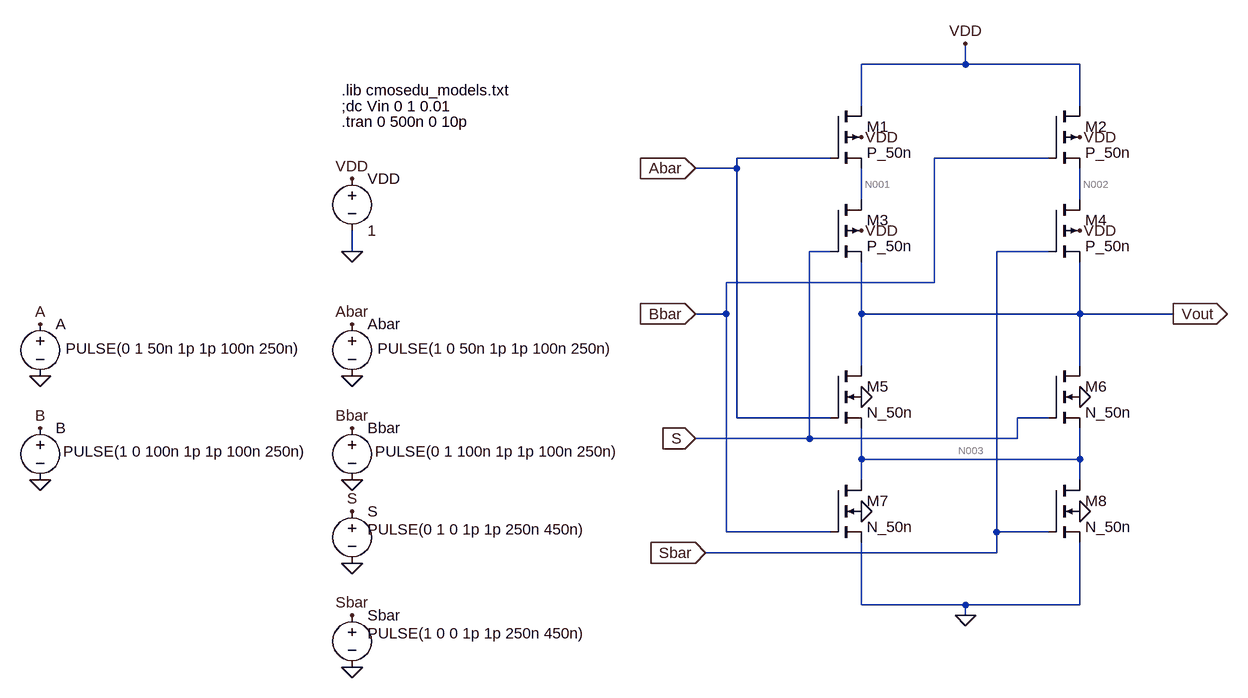
[diagram p0: schematic 2in1MUX.asc]
2in1MUX.asc, the LTspice schematic file:
Version 4
SHEET 1 960 680
WIRE 64 -528 64 -560
WIRE 64 -528 -96 -528
WIRE 240 -528 64 -528
WIRE -96 -464 -96 -528
WIRE 240 -464 240 -528
WIRE -144 -384 -288 -384
WIRE 192 -384 16 -384
WIRE -288 -368 -288 -384
WIRE -288 -368 -352 -368
WIRE -96 -320 -96 -368
WIRE 240 -320 240 -368
WIRE -880 -240 -880 -272
WIRE -144 -240 -176 -240
WIRE 192 -240 112 -240
WIRE 16 -192 16 -384
WIRE 16 -192 -304 -192
WIRE -304 -144 -304 -192
WIRE -304 -144 -352 -144
WIRE -96 -144 -96 -224
WIRE 240 -144 240 -224
WIRE 240 -144 -96 -144
WIRE 384 -144 240 -144
WIRE -96 -64 -96 -144
WIRE 240 -64 240 -144
WIRE -288 16 -288 -368
WIRE -144 16 -288 16
WIRE 192 16 144 16
WIRE -176 48 -176 -240
WIRE -176 48 -352 48
WIRE 144 48 144 16
WIRE 144 48 -176 48
WIRE -96 80 -96 32
WIRE 240 80 240 32
WIRE 240 80 -96 80
WIRE -96 112 -96 80
WIRE 240 112 240 80
WIRE -304 192 -304 -144
WIRE -144 192 -304 192
WIRE 112 192 112 -240
WIRE 192 192 112 192
WIRE 112 224 112 192
WIRE 112 224 -336 224
WIRE -96 304 -96 208
WIRE 64 304 -96 304
WIRE 240 304 240 208
WIRE 240 304 64 304
WIRE 64 320 64 304
FLAG -880 -240 0
FLAG -880 -352 VDD
FLAG -880 -128 Abar
FLAG -880 32 Bbar
FLAG -880 -48 0
FLAG -880 112 0
FLAG -880 160 S
FLAG -880 240 0
FLAG 240 160 0
FLAG 240 -16 0
FLAG -96 -16 0
FLAG -96 160 0
FLAG -96 -416 VDD
FLAG 240 -416 VDD
FLAG 240 -272 VDD
FLAG -96 -272 VDD
FLAG -352 -368 Abar
IOPIN -352 -368 In
FLAG -352 -144 Bbar
IOPIN -352 -144 In
FLAG -352 48 S
IOPIN -352 48 In
FLAG 64 320 0
FLAG 64 -560 VDD
FLAG -880 320 Sbar
FLAG -880 400 0
FLAG -336 224 Sbar
IOPIN -336 224 In
FLAG 384 -144 Vout
IOPIN 384 -144 Out
FLAG -1360 -128 A
FLAG -1360 -48 0
FLAG -1360 32 B
FLAG -1360 112 0
SYMBOL voltage -880 -368 R0
SYMATTR InstName VDD
SYMATTR Value 1
SYMBOL voltage -880 -144 R0
WINDOW 3 39 53 Left 2
WINDOW 123 0 0 Left 0
WINDOW 39 0 0 Left 0
SYMATTR Value PULSE(1 0 50n 1p 1p 100n 250n)
SYMATTR InstName Abar
SYMBOL voltage -880 16 R0
WINDOW 123 0 0 Left 0
WINDOW 39 0 0 Left 0
WINDOW 3 35 52 Left 2
SYMATTR Value PULSE(0 1 100n 1p 1p 100n 250n)
SYMATTR InstName Bbar
SYMBOL pmos4 -144 -464 R0
SYMATTR InstName M1
SYMATTR Value P_50n
SYMATTR Value2 l=50n w=0.8u
SYMBOL pmos4 192 -464 R0
SYMATTR InstName M2
SYMATTR Value P_50n
SYMATTR Value2 l=50n w=0.8u
SYMBOL pmos4 -144 -320 R0
SYMATTR InstName M3
SYMATTR Value P_50n
SYMATTR Value2 l=50n w=0.8u
SYMBOL pmos4 192 -320 R0
SYMATTR InstName M4
SYMATTR Value P_50n
SYMATTR Value2 l=50n w=0.8u
SYMBOL voltage -880 144 R0
WINDOW 123 0 0 Left 0
WINDOW 39 0 0 Left 0
WINDOW 3 24 44 Left 2
SYMATTR Value PULSE(0 1 0 1p 1p 250n 450n)
SYMATTR InstName S
SYMBOL nmos4 -144 -64 R0
SYMATTR InstName M5
SYMATTR Value N_50n
SYMATTR Value2 l=50n w=0.4u
SYMBOL nmos4 192 -64 R0
SYMATTR InstName M6
SYMATTR Value N_50n
SYMATTR Value2 l=50n w=0.4u
SYMBOL nmos4 -144 112 R0
SYMATTR InstName M7
SYMATTR Value N_50n
SYMATTR Value2 l=50n w=0.4u
SYMBOL nmos4 192 112 R0
SYMATTR InstName M8
SYMATTR Value N_50n
SYMATTR Value2 l=50n w=0.4u
SYMBOL voltage -880 304 R0
WINDOW 123 0 0 Left 0
WINDOW 39 0 0 Left 0
WINDOW 3 24 44 Left 2
SYMATTR Value PULSE(1 0 0 1p 1p 250n 450n)
SYMATTR InstName Sbar
SYMBOL voltage -1360 -144 R0
WINDOW 3 39 53 Left 2
WINDOW 123 0 0 Left 0
WINDOW 39 0 0 Left 0
SYMATTR Value PULSE(0 1 50n 1p 1p 100n 250n)
SYMATTR InstName A
SYMBOL voltage -1360 16 R0
WINDOW 123 0 0 Left 0
WINDOW 39 0 0 Left 0
WINDOW 3 35 52 Left 2
SYMATTR Value PULSE(1 0 100n 1p 1p 100n 250n)
SYMATTR InstName B
TEXT -896 -464 Left 2 !;dc Vin 0 1 0.01
TEXT -896 -488 Left 2 !.lib cmosedu_models.txt
TEXT -896 -440 Left 2 !.tran 0 500n 0 10p

The netlist it stands for:
* 2in1MUX.asc
VDD VDD 0 1
V§Abar Abar 0 PULSE(1 0 50n 1p 1p 100n 250n)
V§Bbar Bbar 0 PULSE(0 1 100n 1p 1p 100n 250n)
M1 VDD Abar N001 VDD P_50n l=50n w=0.8u
M2 VDD Bbar N002 VDD P_50n l=50n w=0.8u
M3 N001 S Vout VDD P_50n l=50n w=0.8u
M4 N002 Sbar Vout VDD P_50n l=50n w=0.8u
V§S S 0 PULSE(0 1 0 1p 1p 250n 450n)
M5 Vout Abar N003 0 N_50n l=50n w=0.4u
M6 Vout S N003 0 N_50n l=50n w=0.4u
M7 N003 Bbar 0 0 N_50n l=50n w=0.4u
M8 N003 Sbar 0 0 N_50n l=50n w=0.4u
V§Sbar Sbar 0 PULSE(1 0 0 1p 1p 250n 450n)
V§A A 0 PULSE(0 1 50n 1p 1p 100n 250n)
V§B B 0 PULSE(1 0 100n 1p 1p 100n 250n)
.model NMOS NMOS
.model PMOS PMOS
.lib standard.mos
;dc Vin 0 1 0.01
.lib cmosedu_models.txt
.tran 0 500n 0 10p
.backanno
.end

* Results of the author's LTspice run, read from the files saved beside the schematic
* Operating Point, zero values left out:
*   V(vdd) = 1 V
*   V(abar) = 1 V
*   V(n001) = 170.9 mV
*   V(n002) = 1 V
*   V(vout) = 63.33 µV
*   V(sbar) = 1 V
*   V(n003) = 32.56 µV
*   V(b) = 1 V
*   Id(M8) = 24.12 nA
*   Ig(M8) = 1.39 nA
*   Ib(M8) = -26.22 pA
*   Is(M8) = -25.48 nA
*   Id(M5) = 22.75 nA
*   Ig(M5) = 1.39 nA
*   Ib(M5) = -26.2 pA
*   Is(M5) = -24.12 nA
*   Id(M4) = 5.355 nA
*   Ig(M4) = 8.889 nA
*   Ib(M4) = 1 pA
*   Is(M4) = -14.24 nA
*   Id(M3) = 8.539 nA
*   Ig(M3) = -31.94 pA
*   Ib(M3) = 1.835 pA
*   Is(M3) = -8.509 nA
*   Id(M2) = 19.26 nA
*   Ig(M2) = -14.02 nA
*   Ib(M2) = 111.2 pA
*   Is(M2) = -5.355 nA
*   Id(M1) = 4.123 nA
*   Ig(M1) = 4.415 nA
*   Is(M1) = -8.539 nA
*   I(Sbar) = -10.28 nA
*   I(S) = 31.94 pA
*   I(Bbar) = 14.02 nA
*   I(Abar) = -5.805 nA
*   I(Vdd) = -23.5 nA
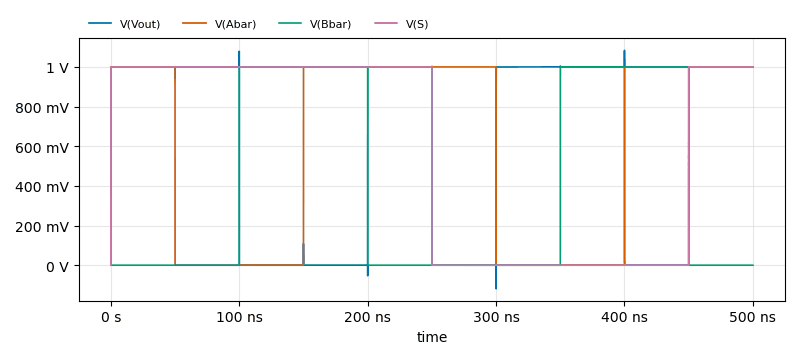
[diagram p1: Transient Analysis of 2in1MUX.asc, plotted from the saved traces]
* Transient Analysis, 1 run:
*   V(Vout): min -119 mV, max 1.084 V, average 599.8 mV, rms 774.3 mV, last 999.9 mV
*   V(Abar): min 0 V, max 1 V, average 600 mV, rms 774.6 mV, last 1 V
*   V(Bbar): min 0 V, max 1 V, average 400 mV, rms 632.5 mV, last 0 V
*   V(S): min 0 V, max 1 V, average 600 mV, rms 774.6 mV, last 1 V